# EAGLE design IAQ-core (EAGLE 8.0.2)
CNAME: IAQ-Core Breakout; CREVISION: V1.0; DESIGNER: November Five
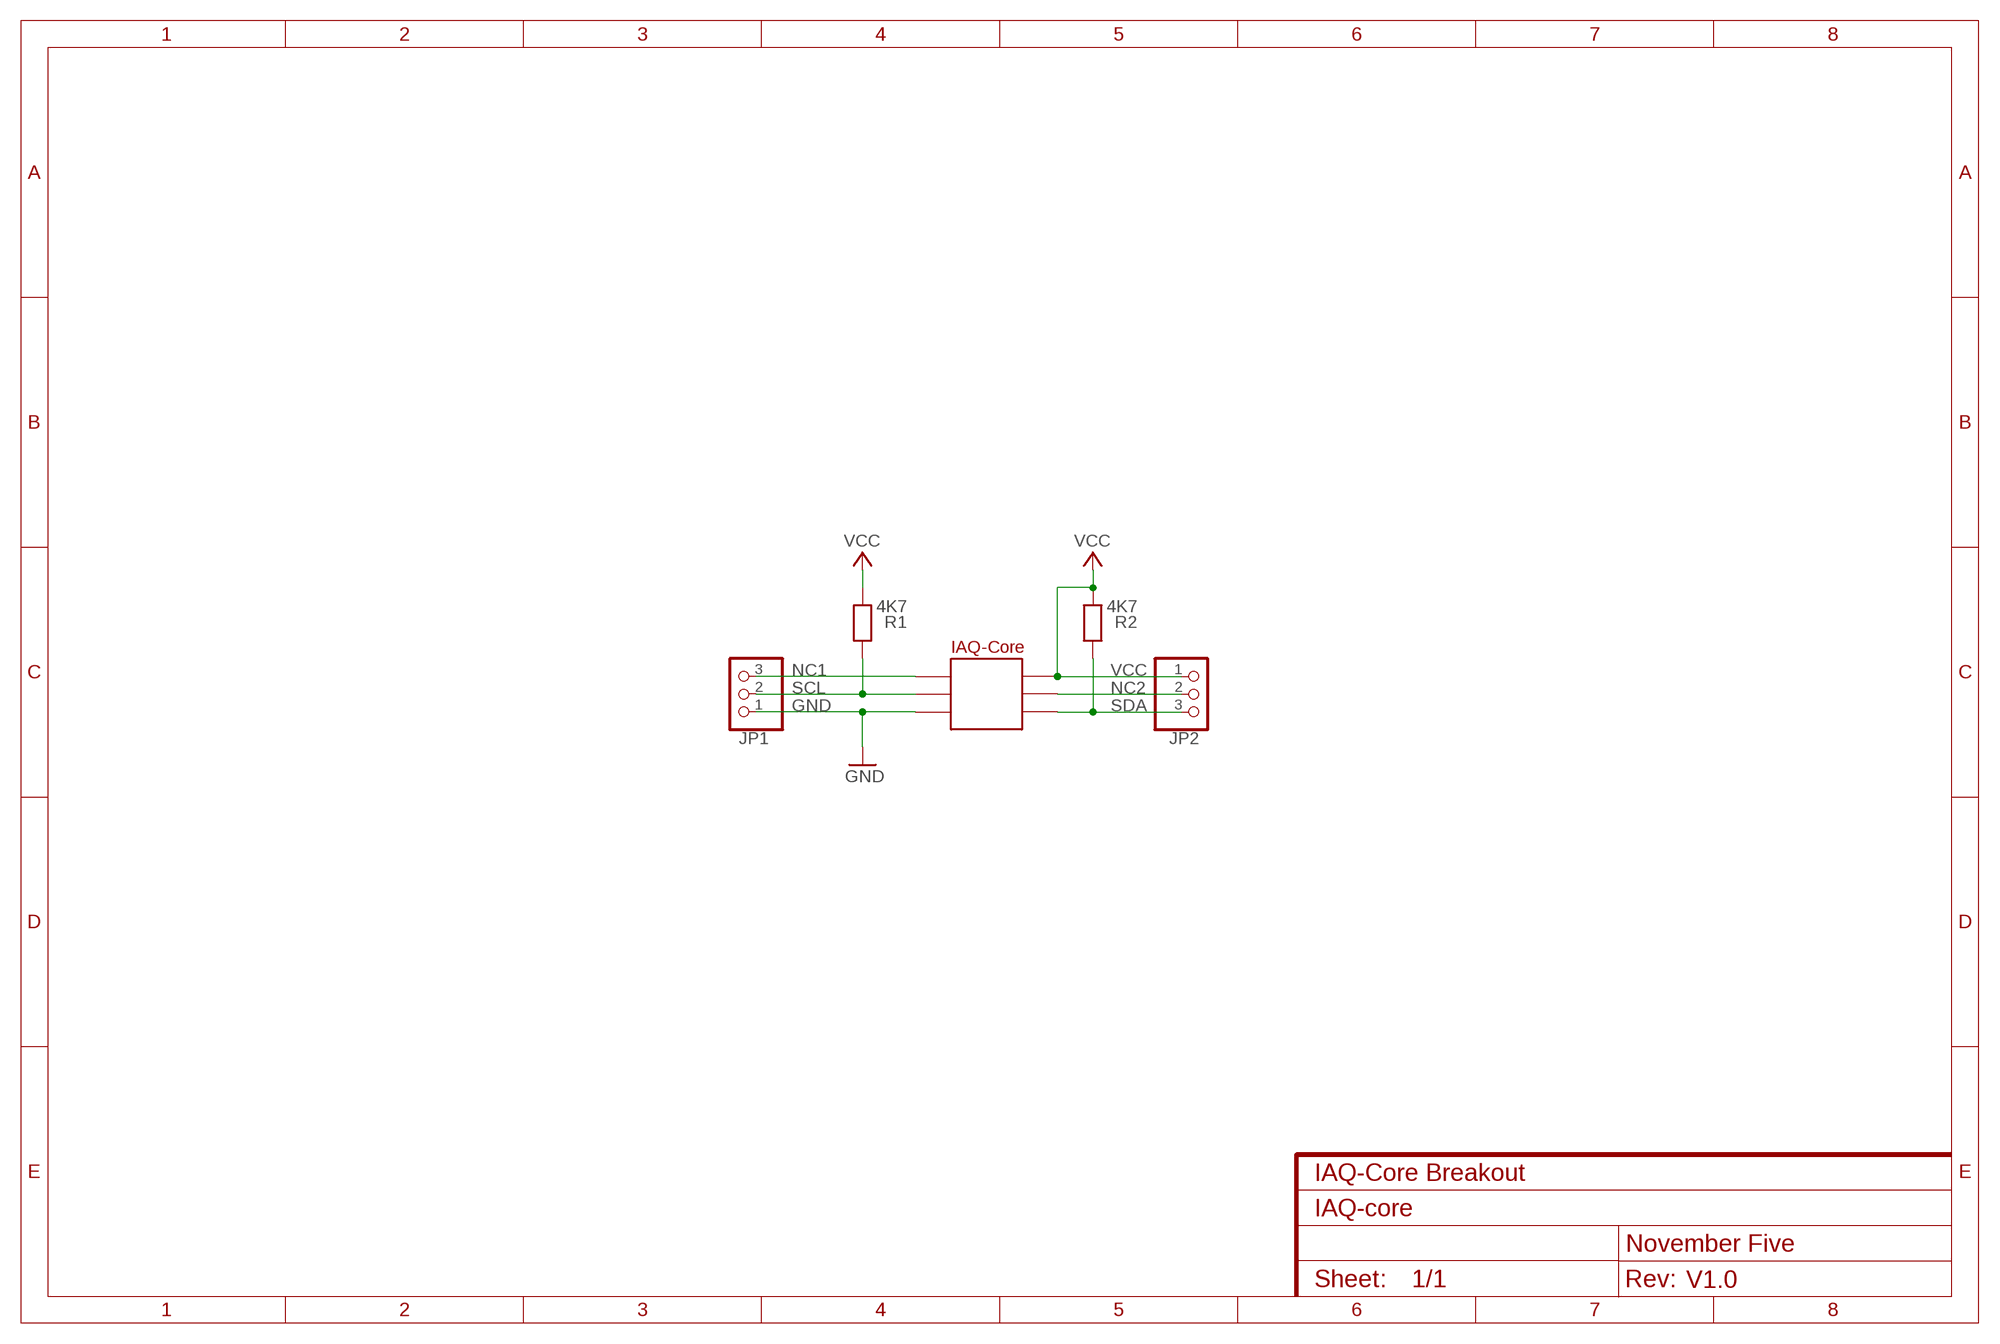
[diagram p0: schematic, sheet 1]

## Parts
IAQ-CORE  IAQ-CORE  [IAQ-CORE]
JP1  PINHD-1X3  [1X03]
JP2  PINHD-1X3  [1X03]
R1  4K7  RESISTOR  [R0603]
R2  4K7  RESISTOR  [R0603]

## Nets
GND: IAQ-CORE.GND JP1.1
NC1: IAQ-CORE.NC1 JP1.3
NC2: IAQ-CORE.NC2 JP2.2
SCL: IAQ-CORE.SCL JP1.2 R1.1
SDA: IAQ-CORE.SDA JP2.3 R2.1
VCC: IAQ-CORE.VCC JP2.1 R1.2 R2.2

## Library data of the parts
IAQ-CORE = IAQ-core:IAQ-CORE
JP1 JP2 = adafruit:PINHD-1X3: PIN HEADER
R1 R2 = NovemberFive-Basic:RESISTOR

## Board
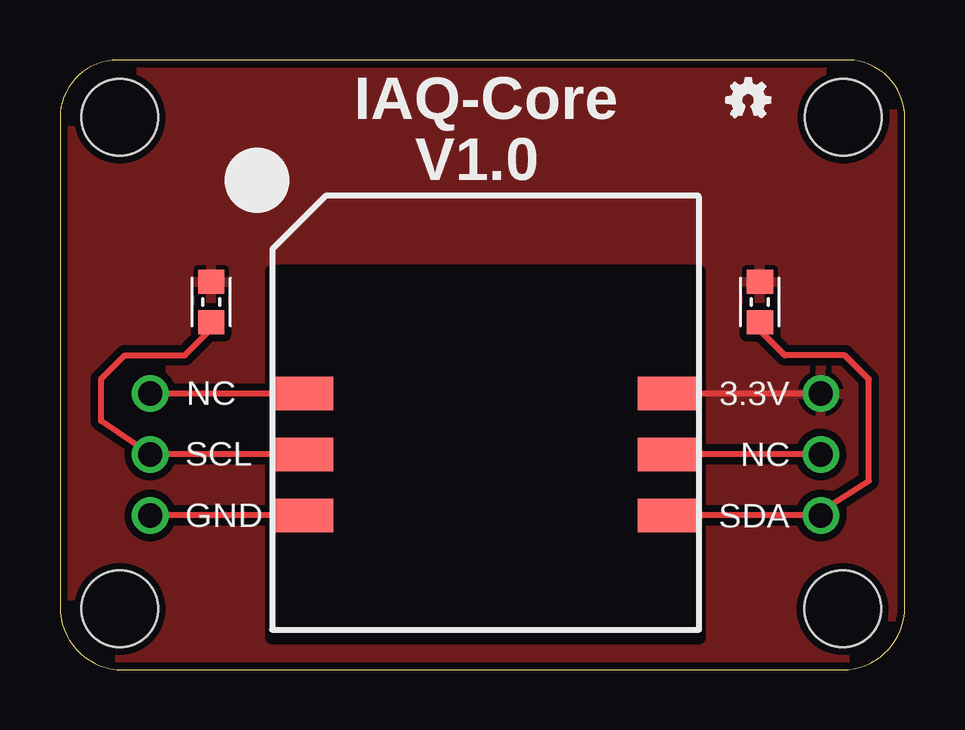
[diagram p1: board, top side]
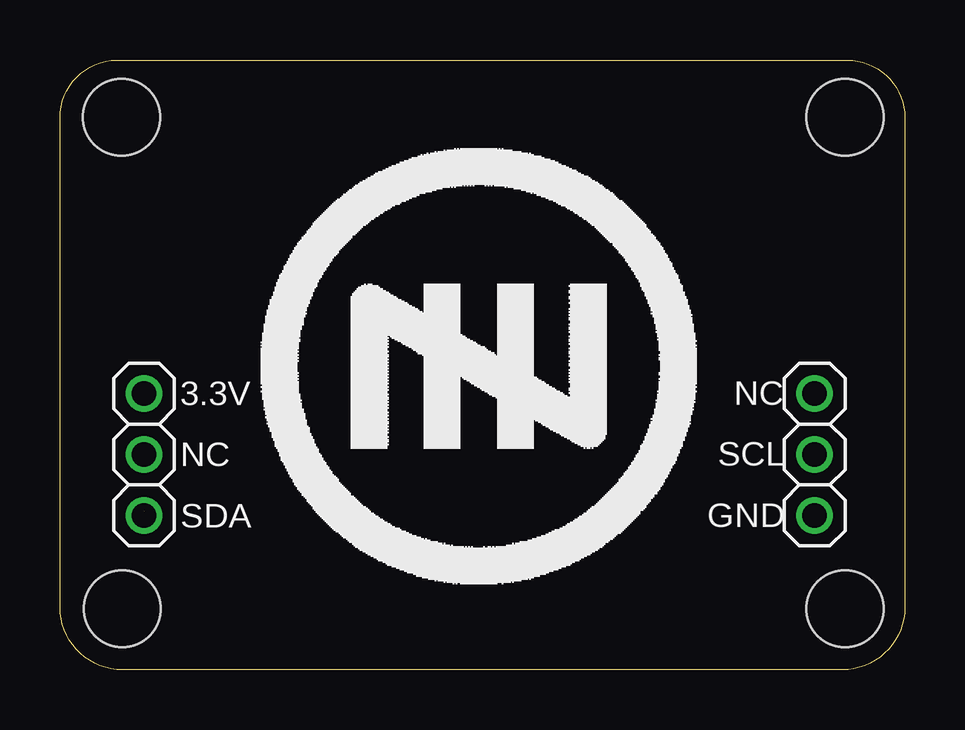
[diagram p2: board, bottom side, seen from below]

Size 35.2 x 25.41 mm. Coordinates in mm from the lower left corner, seen from the top.
Outline: 2.4,25.4 arc90 0,23 0,2.6 arc90 2.6,0 32.6,0 arc90 35.2,2.6 35.2,23 arc95 32.6,25.4 2.4,25.4
Copper layers (1*16): Top 0.018mm / dielectric 1.55mm / Bottom 0.018mm
Design rules "eC_2Layer_PClass6_BaseCopperO18_eCDefault": minimum track width 0.15mm, minimum drill 0.35mm, track to track 0.15mm, track to pad 0.15mm, pad to pad 0.15mm, via to via 0.15mm, smd to smd 0mil, copper to edge 0.25mm, drill to drill 0.35mm, minimum pad ring 0.175mm, minimum via ring 0.125mm, stop-mask expansion 0mil, vias tented up to drill 0.45mm, thermal gap 0.2mm
Holes 3.2 mm at 2.49,23.02 32.64,23.02 2.49,2.54 32.61,2.54

### Footprints (pad centres in the part's own frame; a part is rotated, then mirrored left to right if it is on the bottom)
IAQ-CORE = smd 2.54 x 1.4: GND -7.61,-2.54; NC1 -7.61,2.54; NC2 7.61,0; SCL -7.61,0; SDA 7.61,-2.54; VCC 7.61,2.54
1X03 = drill 1.016: 1 -2.54,0; 2 0,0; 3 2.54,0
R0603 = smd 1 x 1.1: 1 -0.85,0; 2 0.85,0

### Placement (x,y rotation side)
IAQ-CORE  17.73,8.97 0 top
JP1  3.76,8.97 90 bottom
JP2  31.7,8.97 270 bottom
R1  6.3,15.32 90 top
R2  29.16,15.32 90 top
U$1  [LOGO-NOVEMERFIVE-2,5SCALE-MIRROR]  26.8,3.6 0 top
U$2  LOGO-OSHWA  [LOGO-OSHWA]  27.48,22.94 0 top

### Tracks (layer width: path | path; a pad name or v marks a point on that pad's centre or on a via)
GND
  Top 0.25: IAQ-CORE.GND JP1.1
NC1
  Top 0.25: IAQ-CORE.NC1 JP1.3
  Top 0.254: 9.7,11.6 IAQ-CORE.NC1
  Bottom 0.254: 4.2,11.6 JP1.3
NC2
  Top 0.25: JP2.2 IAQ-CORE.NC2
  Top 0.254: IAQ-CORE.NC2 25.7,9.1
SCL
  Top 0.25: 1.7,10.37 JP1.2 IAQ-CORE.SCL
  Top 0.254: 1.7,10.37 1.7,12.1 2.7,13.1 5.2,13.1 6.2,14.1 R1.1 | 9.7,9 IAQ-CORE.SCL
  Bottom 0.254: 3.7,9.1 JP1.2
SDA  (1 unrouted)
  Top 0.25: JP2.3 IAQ-CORE.SDA
  Top 0.254: 31.7,6.6 33.7,7.87 33.7,12.1 32.7,13.1 30.2,13.1 29.2,14.1 R2.1 | IAQ-CORE.SDA 25.7,6.6
  Bottom 0.254: 31.7,6.6 JP2.3
VCC
  Top 0.25: JP2.1 IAQ-CORE.VCC
  Top 0.254: 6.7,16.1 R1.2 | 28.7,16.1 R2.2 28.74,16.17 | 25.2,11.6 IAQ-CORE.VCC 25.7,11.6
  Bottom 0.254: 31.7,11.6 JP2.1
  pour Top (isolate 0.305): -0.05,25.48 35.51,25.48 35.31,0.08 -0.05,0.08

### Text on the board
tPlace: IAQ-Core | V1.0 | NC | 3.3V | SCL | NC | GND | SDA
bPlace: NC | 3.3V | SCL | NC | GND | SDA